# Altium schematic sheet ARDUINO.SCHDOC
size A4
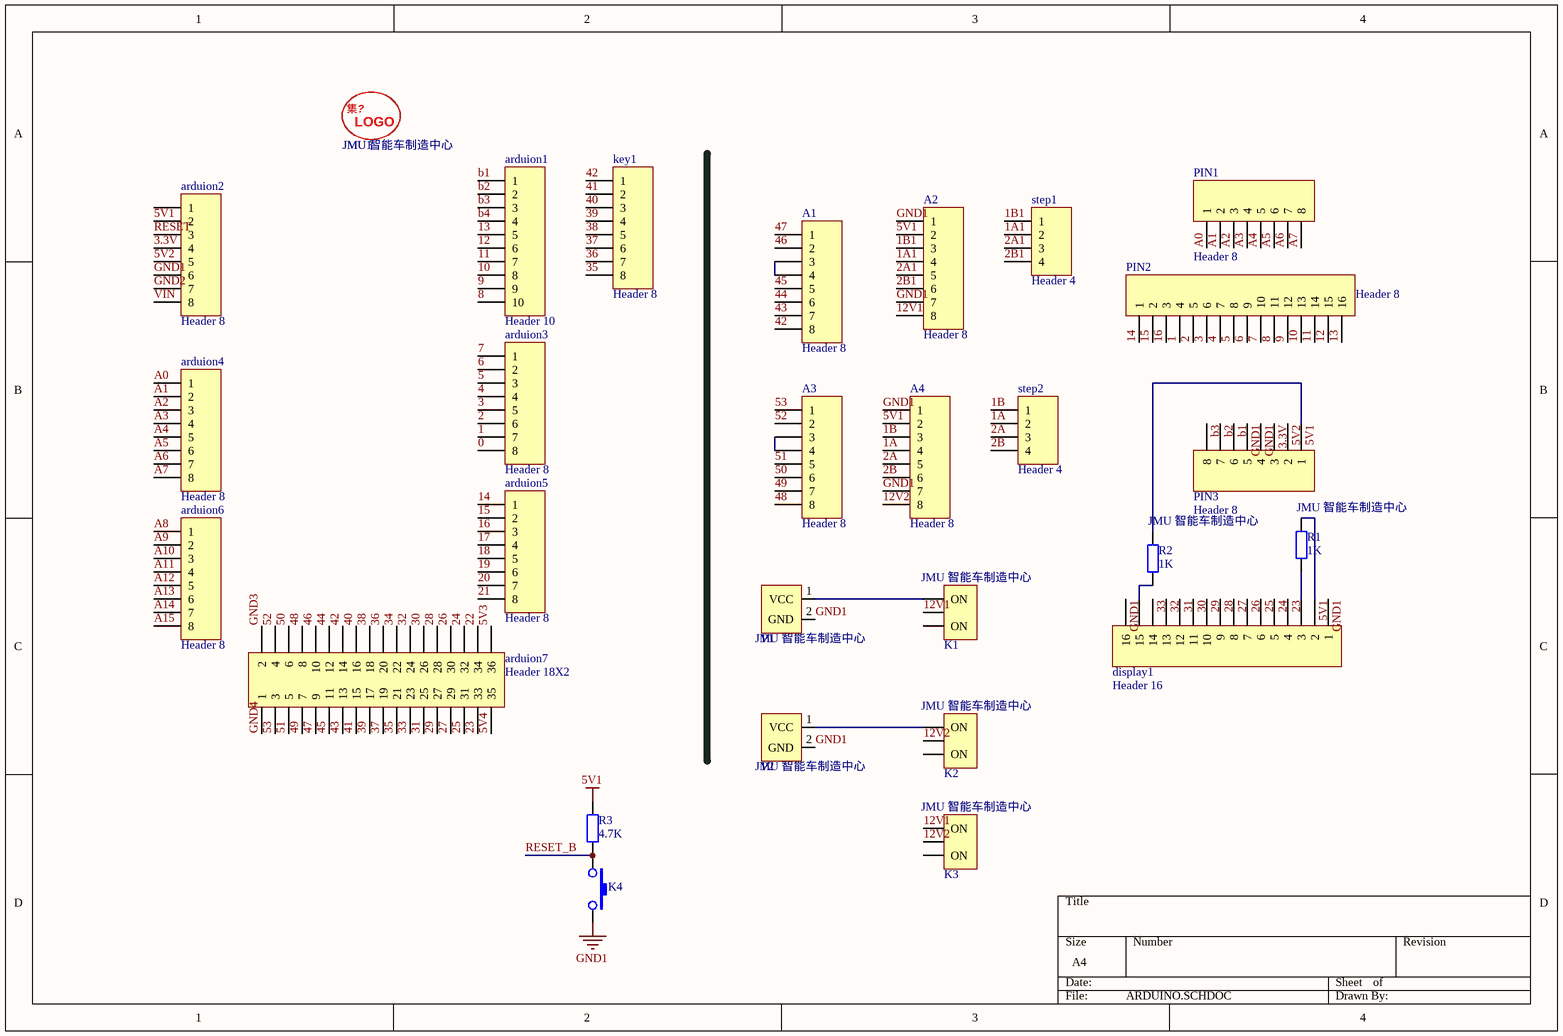
[diagram p0: ARDUINO.SCHDOC]

## Parts
A1  Header 8  [HDR1X8]
A2  Header 8  [HDR1X8]
A3  Header 8  [HDR1X8]
A4  Header 8  [HDR1X8]
arduion1  Header 10  [HDR1X10]
arduion2  Header 8  [HDR1X8]
arduion3  Header 8  [HDR1X8]
arduion4  Header 8  [HDR1X8]
arduion5  Header 8  [HDR1X8]
arduion6  Header 8  [HDR1X8]
arduion7  Header 18X2  [HDR2X18]
display1  Header 16  [HDR1X16]
JMU1  JMU  [JMU_logo（1）]  (value not drawn)
K1  KEY  [钮子开关（大）]  (value not drawn)
K2  KEY  [钮子开关（大）]  (value not drawn)
K3  KEY  [钮子开关（大）]  (value not drawn)
K4  RESET  [SW_PB2_A1]  (value not drawn)
key1  Header 8  [HDR1X8]
P1  Tͷ  [T型接头]  (value not drawn)
P2  Tͷ  [T型接头]  (value not drawn)
PIN1  Header 8  [HDR1X8]
PIN2  Header 8  [HDR1X16]
PIN3  Header 8  [HDR1X8]
R1  1K  [0603]
R2  1K  [0603]
R3  4.7K  [0603-r]
step1  Header 4  [HDR1X4]
step2  Header 4  [HDR1X4]

## Nets
5V1: A2.2 A4.2 arduion2.2 display1.2 PIN3.1 R1.2 R2.2 R3.2
GND1: A2.1 A2.7 A4.1 A4.7 arduion2.6 display1.1 display1.16 K4.2 P1.2(GND) P2.2(GND) PIN3.4 PIN3.5
0: arduion3.8
1: arduion3.7 PIN2.4
1A: A4.4 step2.2
1A1: A2.4 step1.2
1B: A4.3 step2.1
1B1: A2.3 step1.1
2: arduion3.6 PIN2.5
2A: A4.5 step2.3
2A1: A2.5 step1.3
2B: A4.6 step2.4
2B1: A2.6 step1.4
3: arduion3.5 PIN2.6
3.3V: arduion2.4 PIN3.3
4: arduion3.4 PIN2.7
5: arduion3.3 PIN2.8
5V2: arduion2.5 PIN3.2
5V3: arduion7.36
5V4: arduion7.35
6: arduion3.2 PIN2.9
7: arduion3.1 PIN2.10
8: arduion1.10 PIN2.11
9: arduion1.9 PIN2.12
10: arduion1.8 PIN2.13
11: arduion1.7 PIN2.14
12: arduion1.6 PIN2.15
12V1: A2.8 K1.2(com) K3.1(ON)
12V2: A4.8 K2.2(com) K3.2(com)
13: arduion1.5 PIN2.16
14: arduion5.1 PIN2.1
15: arduion5.2 PIN2.2
16: arduion5.3 PIN2.3
17: arduion5.4
18: arduion5.5
19: arduion5.6
20: arduion5.7
21: arduion5.8
22: arduion7.34
23: arduion7.33 display1.4
24: arduion7.32 display1.5
25: arduion7.31 display1.6
26: arduion7.30 display1.7
27: arduion7.29 display1.8
28: arduion7.28 display1.9
29: arduion7.27 display1.10
30: arduion7.26 display1.11
31: arduion7.25 display1.12
32: arduion7.24 display1.13
33: arduion7.23 display1.14
34: arduion7.22
35: arduion7.21 key1.8
36: arduion7.20 key1.7
37: arduion7.19 key1.6
38: arduion7.18 key1.5
39: arduion7.17 key1.4
40: arduion7.16 key1.3
41: arduion7.15 key1.2
42: A1.8 arduion7.14 key1.1
43: A1.7 arduion7.13
44: A1.6 arduion7.12
45: A1.5 arduion7.11
46: A1.2 arduion7.10
47: A1.1 arduion7.9
48: A3.8 arduion7.8
49: A3.7 arduion7.7
50: A3.6 arduion7.6
51: A3.5 arduion7.5
52: A3.2 arduion7.4
53: A3.1 arduion7.3
A0: arduion4.1 PIN1.1
A1: arduion4.2 PIN1.2
A2: arduion4.3 PIN1.3
A3: arduion4.4 PIN1.4
A4: arduion4.5 PIN1.5
A5: arduion4.6 PIN1.6
A6: arduion4.7 PIN1.7
A7: arduion4.8 PIN1.8
A8: arduion6.1
A9: arduion6.2
A10: arduion6.3
A11: arduion6.4
A12: arduion6.5
A13: arduion6.6
A14: arduion6.7
A15: arduion6.8
b1: arduion1.1 PIN3.6
b2: arduion1.2 PIN3.7
b3: arduion1.3 PIN3.8
b4: arduion1.4
GND2: arduion2.7
GND3: arduion7.2
GND4: arduion7.1
RESET: arduion2.3
RESET_B: K4.1 R3.1
VIN: arduion2.8
NetA1_3: A1.3 A1.4
NetA3_3: A3.3 A3.4
Netdisplay1_3: display1.3 R1.1
Netdisplay1_15: display1.15 R2.1
NetK1_1: K1.1(ON) P1.1(VCC)
NetK2_1: K2.1(ON) P2.1(VCC)

Not connected (* = marked no-connect by the designer): arduion2 1; K1 3(ON); K2 3(ON); K3 3(ON)

## Notes on the sheet
- (in symbol JMU-LOGO) 集?; LOGO; JMU 智能车制造中心
- (in symbol Res) JMU 智能车制造中心
- (in symbol 电源接线端子) JMU 智能车制造中心
- (in symbol 钮子开关（大）) JMU 智能车制造中心

## Library data of the parts
A1-A4 arduion2-arduion6 key1 PIN1 PIN3 = Header 8: Header, 8-Pin; LatestRevisionDate: 17-Jul-2002; LatestRevisionNote: Re-released for DXP Platform.; Publisher: Altium Limited
arduion1 = Header 10: Header, 10-Pin; LatestRevisionDate: 17-Jul-2002; LatestRevisionNote: Re-released for DXP Platform.; Publisher: Altium Limited
arduion7 = Header 18X2: Header, 18-Pin, Dual row; LatestRevisionDate: 17-Jul-2002; LatestRevisionNote: Re-released for DXP Platform.; Publisher: Altium Limited
display1 PIN2 = Header 16: Header, 16-Pin; LatestRevisionDate: 17-Jul-2002; LatestRevisionNote: Re-released for DXP Platform.; Publisher: Altium Limited
JMU1 = JMU-LOGO
K1-K3 = 钮子开关（大）: AC 250V/6A
K4 = KE: 按键
P1 P2 = 电源接线端子: T型头
R1 R2 = Res: 通用电阻; Value: 10K
R3 = RES
step1 step2 = Header 4: Header, 4-Pin; LatestRevisionDate: 17-Jul-2002; LatestRevisionNote: Re-released for DXP Platform.; Publisher: Altium Limited